# EasyEDA schematic SCH_DDM4351_EA_Circuit_Group_3_2022-05-29.json
TITLE: DDM4351_EA_Circuits_Group_3; REV: 1.0; Date: 2022-05-14; Sheet: 1/1; Drawn By: LAU Ka Pui; Company: smartMedia-grp2/GitHub
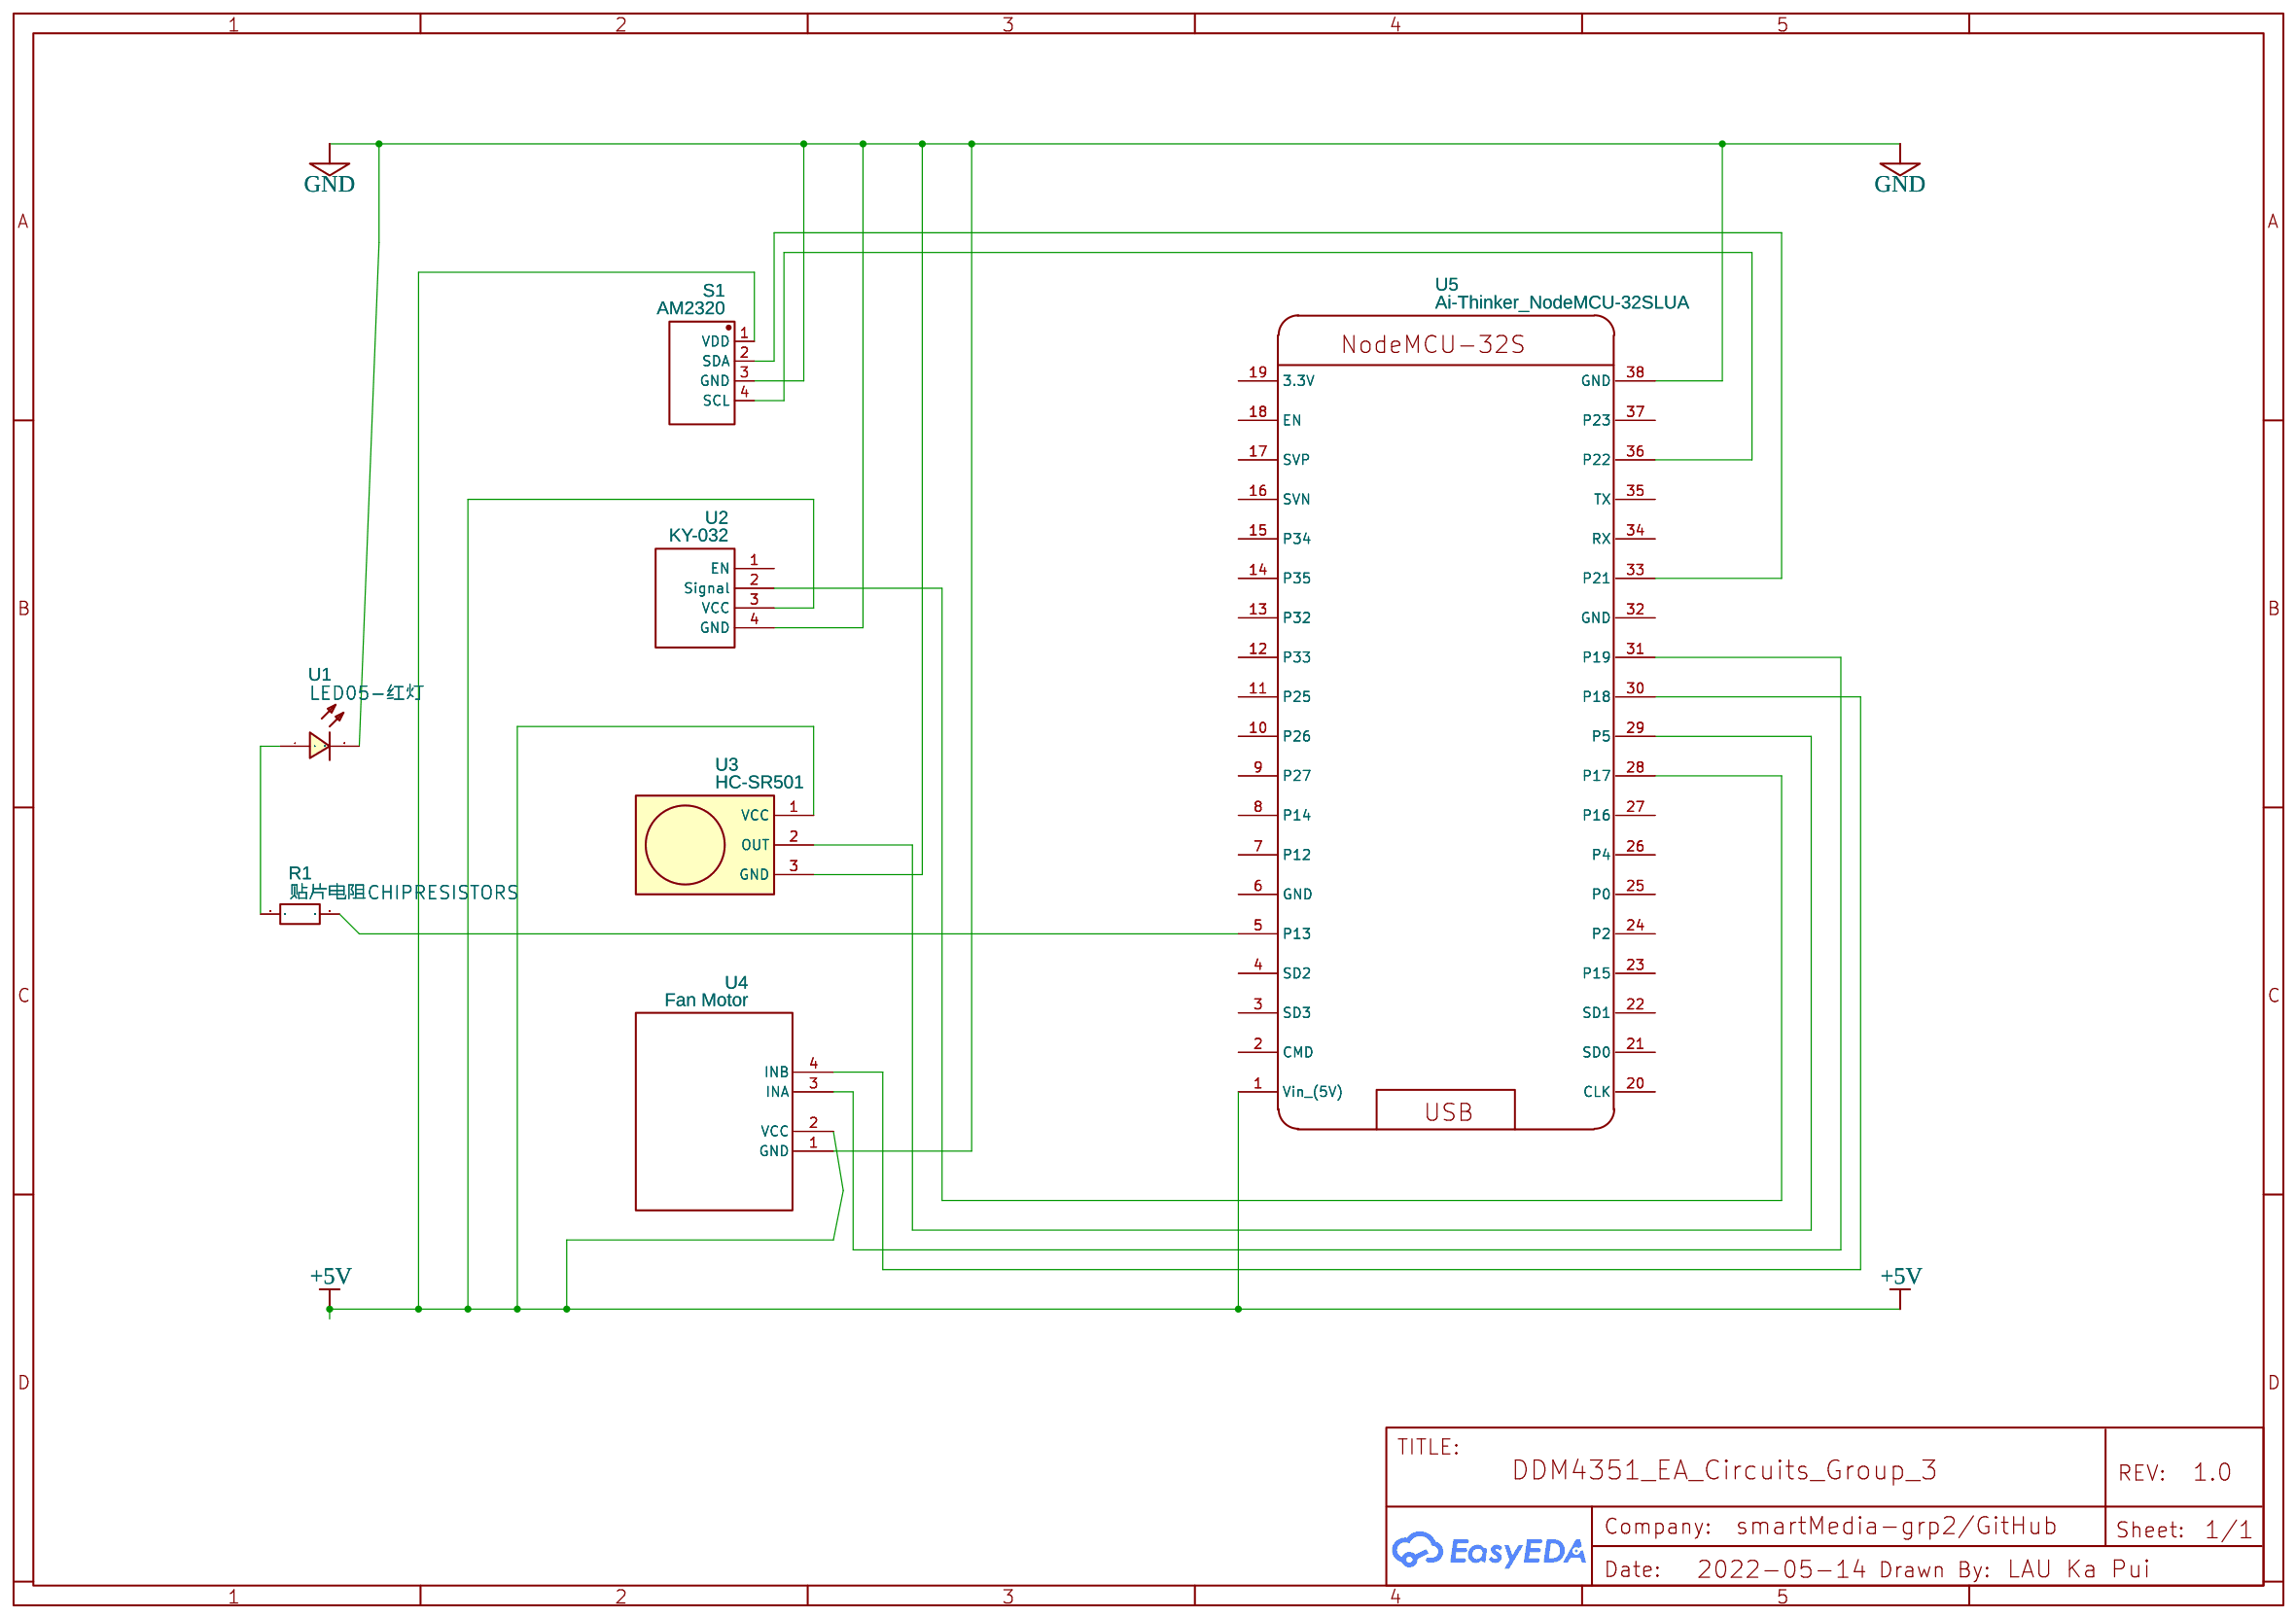
[diagram p0: schematic sheet]

## Parts
R1  贴片电阻CHIPRESISTORS  [R0603]
S1  AM2320  [SENSOR-TH_AM2320]
U1  LED05-红灯  [LED-TH_LED-3MM_RED]
U2  KY-032
U3  HC-SR501  [HC-SR501]
U4  Fan Motor  [GROVE - VIBRATION MOTOR]
U5  Ai-Thinker_NodeMCU-32SLUA  [AI-THINKER_NODEMCU-32SLUA]

## Library data of the parts
R1 = 贴片电阻CHIPRESISTORS: Supplier: LCSC; Supplier Part: C9900014833; Manufacturer: null; Manufacturer Part: 贴片电阻ChipResistors; link: https://atta.szlcsc.comnull; JLCPCB Part Class: Extended Part; Contributor: lcsc
S1 = AM2320: Supplier: LCSC; Manufacturer: AOSONG; Supplier Part: C87932; JLCPCB Part Class: Extended Part
U1 = LED05-红灯: Supplier: LCSC; Supplier Part: C9900009041; Manufacturer: null; Contributor: LCSC; JLCPCB Part Class: Extended Part
U2 = KY-032: Manufacturer Part: Personal; Contributor: paulo0290
U3 = HC-SR501: Contributor: dkomanich; sourceId: COI0iASar
U4 = Grove - Vibration Motor: sourceId: JLFWQ8qkC; Supplier Part: undefined; Supplier: SeeedStudio
U5 = Ai-Thinker_NodeMCU-32SLUA: Supplier: LCSC; Supplier Part: C111436; Manufacturer: Ai-Thinker; Manufacturer Part: NodeMCU-32SLua; Contributor: jobsonp checked by LCSC

## Nets
+5V: S1.1(VDD) U2.3(VCC) U3.1(VCC) U4.2(VCC) U5.1(Vin (5V))
GND: S1.3(GND) U1.2 U2.4(GND) U3.3(GND) U4.1(GND) U5.38(GND)
Net-(R1-1): R1.1 U1.1
Net-(R1-2): R1.2 U5.5(P13)
Net-(S1-2): S1.2(SDA) U5.33(P21)
Net-(S1-4): S1.4(SCL) U5.36(P22)
Net-(U2-2): U2.2(Signal) U5.28(P17)
Net-(U3-2): U3.2(OUT) U5.29(P5)
Net-(U4-3): U4.3(INA) U5.31(P19)
Net-(U4-4): U4.4(INB) U5.30(P18)

Not connected (* = marked no-connect by the designer): U2 1(EN); U5 2(CMD) 3(SD3) 4(SD2) 6(GND) 7(P12) 8(P14) 9(P27) 10(P26) 11(P25) 12(P33) 13(P32) 14(P35) 15(P34) 16(SVN) 17(SVP) 18(EN) 19(3.3V) 20(CLK) 21(SD0) 22(SD1) 23(P15) 24(P2) 25(P0) 26(P4) 27(P16) 32(GND) 34(RX) 35(TX) 37(P23)
